# Altium schematic sheet Connectors and USB.SchDoc: Connectors and USB
size A4; DrawnBy: Alex Dyer; Revision: A; SheetNumber: 3; SheetTotal: 5
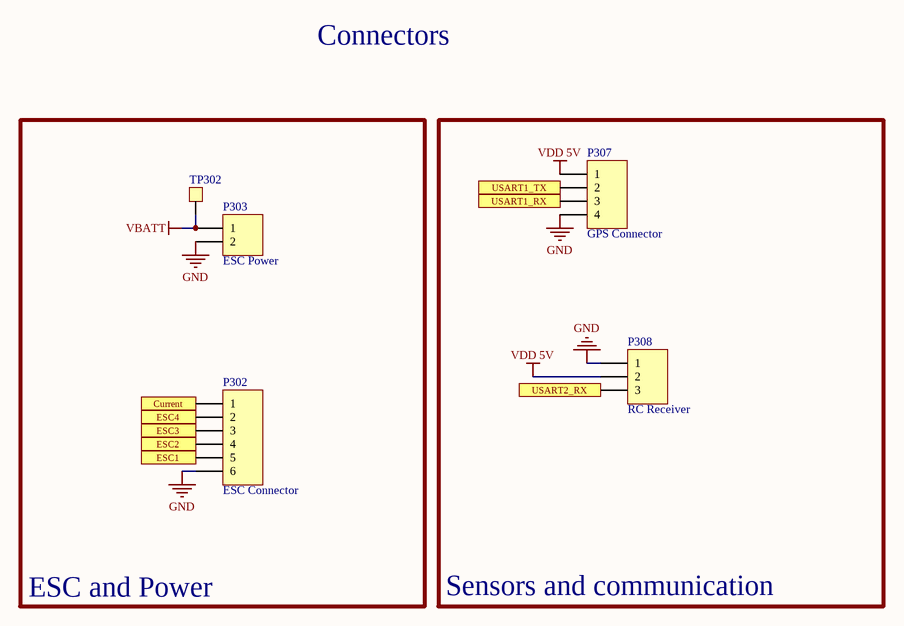
[diagram p0: Connectors and USB.SchDoc]

## Parts
P302  ESC Connector  [B6B-XH-A]
P303  ESC Power  [HDR1X2]
P307  GPS Connector  [B4B-XH-A]
P308  RC Receiver  [B3B-XH-A]
TP302  Test Point  [Test Point THT 1mm]  (value not drawn)

## Blocks framed on the sheet
ESC and Power: P302 P303 TP302
Sensors and communication: P307 P308

## Ports
Current, ESC1, ESC2, ESC3, ESC4, USART1_RX, USART1_TX, USART2_RX

## Nets
GND: P302.6 P303.2 P307.4 P308.1
VBATT: P303.1 TP302.1
VDD 5V: P307.1 P308.2
Current: P302.1 ; port Current
ESC1: P302.5 ; port ESC1
ESC2: P302.4 ; port ESC2
ESC3: P302.3 ; port ESC3
ESC4: P302.2 ; port ESC4
USART1_RX: P307.3 ; port USART1_RX
USART1_TX: P307.2 ; port USART1_TX
USART2_RX: P308.3 ; port USART2_RX

## Notes on the sheet
- Connectors
- Title:
- Size:
- Date:
- A4
- Drawn By:
- Time:
- Sheet
- Revision:
- of

## Library data of the parts
P302 = Header 6: Header, 6-Pin; LatestRevisionDate: 17-Jul-2002; LatestRevisionNote: Re-released for DXP Platform.; Publisher: Altium Limited; Purchase: https://uk.farnell.com/jst-japan-solderless-terminals/b6b-xh-a-lf-sn/connector-header-tht-2-5mm-6way/dp/1516282?ost=b6b-xh-a
P303 = Header 2: Header, 2-Pin; LatestRevisionDate: 17-Jul-2002; LatestRevisionNote: Re-released for DXP Platform.; Publisher: Altium Limited; Purchase: https://hobbyking.com/en_us/nylon-xt60-connectors-male-female-5-pairs-genuine.html?___store=en_us
P307 = Header 4: Header, 4-Pin; LatestRevisionDate: 17-Jul-2002; LatestRevisionNote: Re-released for DXP Platform.; Publisher: Altium Limited; Purchase: https://uk.farnell.com/jst-japan-solderless-terminals/b4b-xh-a-lf-sn/header-vertical-4way/dp/1516278?st=b4b-xh-a
P308 = Header 3: Header, 3-Pin; LatestRevisionDate: 17-Jul-2002; LatestRevisionNote: Re-released for DXP Platform.; Publisher: Altium Limited; Purchase: https://uk.farnell.com/jst-japan-solderless-terminals/b3b-xh-a-lf-sn/header-vertical-3way/dp/1516277?ost=b3b-xh-a
TP302 = Test Point: ComponentLink1Description: Purchase; ComponentLink1URL: https://uk.rs-online.com/web/p/terminal-posts/2622179/?relevancy-data=7365617263685F636173636164655F6F726465723D31267365617263685F696E746572666163655F6E616D653D4931384E525353746F636B4E756D626572267365617263685F6C616E67756167655F757365643D656E267365617263685F6D617463685F6D6F64653D6D61746368616C6C267365617263685F7061747465726E5F6D6174636865643D5E2828282872737C5253295B205D3F293F285C647B337D5B5C2D5C735D3F5C647B332C347D5B705061415D3F29297C283235285C647B387D7C5C647B317D5C2D5C647B377D29292924267365617263685F7061747465726E5F6F726465723D31267365617263685F73745F6E6F726D616C697365643D59267365617263685F726573706F6E73655F616374696F6E3D267365617263685F747970653D52535F53544F434B5F4E554D424552267365617263685F77696C645F63617264696E675F6D6F64653D4E4F4E45267365617263685F6B6579776F72643D3236322D32313739267365617263685F6B6579776F72645F6170703D32363232313739267365617263685F636F6E6669673D3026&searchHistory=%7B%22enabled%22%3Atrue%7D\; Purchase: https://uk.rs-online.com/web/p/terminal-posts/2622179/?relevancy-data=7365617263685F636173636164655F6F726465723D31267365617263685F696E746572666163655F6E616D653D4931384E525353746F636B4E756D626572267365617263685F6C616E67756167655F757365643D656E267365617263685F6D617463685F6D6F64653D6D61746368616C6C267365617263685F7061747465726E5F6D6174636865643D5E2828282872737C5253295B205D3F293F285C647B337D5B5C2D5C735D3F5C647B332C347D5B705061415D3F29297C283235285C647B387D7C5C647B317D5C2D5C647B377D29292924267365617263685F7061747465726E5F6F726465723D31267365617263685F73745F6E6F726D616C697365643D59267365617263685F726573706F6E73655F616374696F6E3D267365617263685F747970653D52535F53544F434B5F4E554D424552267365617263685F77696C645F63617264696E675F6D6F64653D4E4F4E45267365617263685F6B6579776F72643D3236322D32313739267365617263685F6B6579776F72645F6170703D32363232313739267365617263685F636F6E6669673D3026&searchHistory=%7B%22enabled%22%3Atrue%7D\